# Altium schematic sheet VCXO_25M_DDMTD.SchDoc
size A4; SheetNumber: 7; SheetTotal: 18
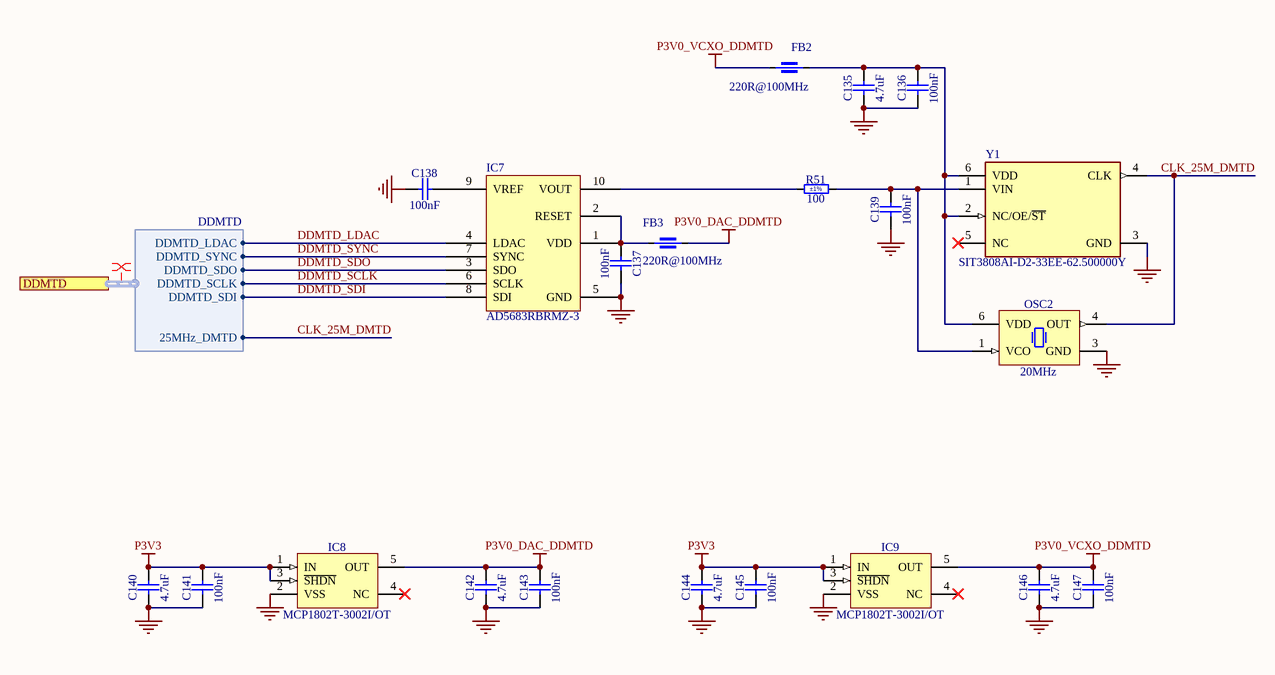
[diagram p0: VCXO_25M_DDMTD.SchDoc]

## Parts
C135  4.7uF  [CAPC1005X55N]
C136  100nF  [CAPC0603X33N]
C137  100nF  [CAPC0603X33N]
C138  100nF  [CAPC0603X33N]
C139  100nF  [CAPC2012X88N]
C140  4.7uF  [CAPC1005X55N]
C141  100nF  [CAPC0603X33N]
C142  4.7uF  [CAPC1005X55N]
C143  100nF  [CAPC0603X33N]
C144  4.7uF  [CAPC1005X55N]
C145  100nF  [CAPC0603X33N]
C146  4.7uF  [CAPC1005X55N]
C147  100nF  [CAPC0603X33N]
FB2  220R@100MHz  [INDC1608X95N]
FB3  220R@100MHz  [INDC1608X95N]
IC7  AD5683RBRMZ-3  [SOP50P490X109-10N]
IC8  MCP1802T-3002I/OT  [SOT95P270X145-5N]
IC9  MCP1802T-3002I/OT  [SOT95P270X145-5N]
OSC2  20MHz  [OSC_CONNOR-WINFIELD_DOT050V]
R51  100  Tolerance: ±1%  [RESC1005X40N]
Y1  SIT3808AI-D2-33EE-62.500000Y  [FP-SiT3808-D-MFG]

## Ports
DDMTD (harness DDMTD, see SPEC-A7-TOP[2B], FPGA_14_15[1D])

## Harnesses
DDMTD: DDMTD_LDAC, DDMTD_SYNC, DDMTD_SCLK, DDMTD_SDI, DDMTD_SDO, 25MHz_DMTD

## Nets
GND: C135.1 C136.1 C137.1 C138.1 C139.1 C140.1 C141.1 C142.1 C143.1 C144.1 C145.1 C146.1 C147.1 IC7.5(GND) IC8.2(VSS) IC9.2(VSS) OSC2.3(GND) Y1.3(GND)
P3V0_DAC_DDMTD: C142.2 C143.2 FB3.1 IC8.5(OUT)
P3V0_VCXO_DDMTD: C146.2 C147.2 FB2.1 IC9.5(OUT)
P3V3: C140.2 C141.2 C144.2 C145.2 IC8.1(IN) IC8.3(~{SHDN}) IC9.1(IN) IC9.3(~{SHDN})
CLK_25M_DMTD: OSC2.4(OUT) Y1.4(CLK) ; port DDMTD.25MHz_DMTD
DDMTD_LDAC: IC7.4(LDAC) ; port DDMTD.DDMTD_LDAC
DDMTD_SCLK: IC7.6(SCLK) ; port DDMTD.DDMTD_SCLK
DDMTD_SDI: IC7.8(SDI) ; port DDMTD.DDMTD_SDI
DDMTD_SDO: IC7.3(SDO) ; port DDMTD.DDMTD_SDO
DDMTD_SYNC: IC7.7(SYNC) ; port DDMTD.DDMTD_SYNC
NetC135_2: C135.2 C136.2 FB2.2 OSC2.6(VDD) Y1.2(NC/OE/~{ST}) Y1.6(VDD)
NetC137_2: C137.2 FB3.2 IC7.1(VDD) IC7.2(RESET)
NetC138_2: C138.2 IC7.9(VREF)
NetC139_2: C139.2 OSC2.1(VCO) R51.2 Y1.1(VIN)
NetIC7_10: IC7.10(VOUT) R51.1

Not connected (* = marked no-connect by the designer): IC8 4(NC)*; IC9 4(NC)*; Y1 5(NC)*

## Layout directives
net class DDMTD: (no net found under the mark)

## Library data of the parts
C135 C140 C142 C144 C146 = CC0402_4.7UF_6.3V_20%_X5R: Non-polarised capacitor; Part Description: SMD Multilayer Chip Ceramic Capacitor; Manufacturer: GENERIC; Manufacturer1 Part Number: C1005X5R0J475M050BC; Voltage: 6.3V; TC: X5R; Tolerance: ±20%; Part Number: CC0402_4.7UF_6.3V_20%_X5R; Component Kind: Standard; Component Type: Standard; Pin Count: 2; Value: 4.7uF; Status: Preferred; Manufacturer Part Number: CC0402_4.7UF_6.3V_20%_X5R; Case: 0402; Mounted: Yes; Socket: No; SMD: Yes; Sense: No; Manufacturer1 Example: TDK; Manufacturer1 ComponentHeight: 0.65mm; HelpURL: \\cern.ch\dfs\Applications\Altium\Datasheets\CC0402_X5R_TDK_C.pdf; Author: CERN DEM JLC; CreateDate: 03.03.2015; LatestRevisionDate: 03.03.2015
C136-C138 C141 C143 C145 C147 = CC0201_100NF_6.3V_10%_X5R: Non-polarised capacitor; Part Description: SMD Multilayer Chip Ceramic Capacitor; Manufacturer: GENERIC; Manufacturer1 Part Number: 02016D104KAT2A; Voltage: 6.3V; TC: X5R; Tolerance: ±10%; Part Number: CC0201_100NF_6.3V_10%_X5R; Component Kind: Standard; Component Type: Standard; Pin Count: 2; Value: 100nF; Status: Not Recommended; Manufacturer Part Number: CC0201_100NF_6.3V_10%_X5R; Case: 0201; Mounted: Yes; Socket: No; SMD: Yes; Sense: No; Manufacturer1 Example: AVX; Manufacturer1 ComponentHeight: 0.33mm; HelpURL: \\cern.ch\dfs\Applications\Altium\Datasheets\CC0201_X5R_AVX.pdf; Author: CERN DEM JLC; CreateDate: 03.12.2007; LatestRevisionDate: 03.12.2007
C139 = CC0805_100NF_50V_1%_NP0: Non-polarised capacitor; Part Description: SMD Multilayer Chip Ceramic Capacitor; Manufacturer: GENERIC; Manufacturer1 Part Number: 0805N103F500C; Voltage: 50V; TC: C0G/NP0; Tolerance: ±1%; Part Number: CC0805_100NF_50V_1%_NP0; Component Kind: Standard; Component Type: Standard; Footprint: CAPC2012X135N; Pin Count: 2; Value: 100nF; Status: Not Recommended; Manufacturer Part Number: CC0805_100NF_50V_1%_NP0; Case: 0805; Mounted: Yes; Socket: No; SMD: Yes; Sense: No; Manufacturer1 Example: WALSIN TECHNOLOGY CORPORATION; Manufacturer1 ComponentHeight: 1.35mm; HelpURL: \\cern.ch\dfs\Applications\Altium\Datasheets\CC0805_WALSIN_0805.pdf; Author: CERN DEM HF; CreateDate: 28.08.2023; LatestRevisionDate: 28.08.2023; ComponentHeight: 1.35mm
FB2 FB3 = IND0603_MURATA_BLM18SG221TN1: Part Description: SMD EMIFIL Suppression Chip Ferrite Bead; Manufacturer: MURATA; Tolerance: ±25%; Power: 2.5A; Resistance: 0.04R; Part Number: IND0603_MURATA_BLM18SG221TN1; Component Kind: Standard; Component Type: Standard; Pin Count: 2; Value: 220R@100MHz; Manufacturer Part Number: BLM18SG221TN1; Case: 0603; Mounted: Yes; Socket: No; SMD: Yes; Sense: No; ComponentHeight: 0.95mm; HelpURL: \\cern.ch\dfs\Applications\Altium\Datasheets\IND0603_MURATA_BLM18S.pdf; Author: CERN DEM MR; CreateDate: 08.01.2016; LatestRevisionDate: 25.10.2018
IC8 IC9 = MCP1802T-3002I/OT: 300mA, High PSRR, Low Quiescent Current LDO; Part Description: 3V, 300mA, High PSRR, Low Quiescent Current LDO; Manufacturer: MICROCHIP TECHNOLOGY; PressFit: No; Bonding: No; Part Number: MCP1802T-3002I/OT; Component Kind: Standard; Component Type: Standard; Device: MCP1802T-3002I/OT; PackageDescription: SOT, 0.95mm Pitch; 5 Pin,1.55mm W X 2.90mm L X 1.45mm H body, IPC Medium Density; Manufacturer Part Number: MCP1802T-3002I/OT; Pin Count: 3; Case: SOT23-5; Mounted: Yes; Socket: No; SMD: Yes; Sense: No; ComponentHeight: 1.45mm; HelpURL: \\cern.ch\dfs\Applications\Altium\Datasheets\MCP1802T-3002I-OT.pdf; Author: CERN DEM JLC; CreateDate: 03.05.2012; LatestRevisionDate: 17.09.2014
OSC2 = OSC_20MHZ_CONNOR-WINFIELD_DOT050V-020.0M: Oscillator 4 pins 1=VCO 3=GND 4=OUT 6=VCC; Part Description: 3.3V, ±0.05ppm, 15pF, 0 to 70°C, LVCMOS, Precision Surface Mount VCTCXO Temperature Compensated Crystal Oscillator, DOT050V Series; PressFit: No; Bonding: No; Part Number: OSC_20MHZ_CONNOR-WINFIELD_DOT050V-020.0M; Component Kind: Standard; Component Type: Standard; PackageDescription: SMD VCTCXO, Side Concave, 6 Pins, 9.00mm x 14.0mm, DOT050V Series; Value: 20MHz; Manufacturer: CONNOR-WINFIELD; Manufacturer Part Number: DOT050V-020.0M; Pin Count: 6; Mounted: Yes; Socket: No; SMD: Yes; Sense: No; ComponentHeight: 6.86mm; HelpURL: \\cern.ch\dfs\Applications\Altium\Datasheets\OSC_CONNOR-WINFIELD_DOT050V.pdf; Author: CERN DEM BC; CreateDate: 04.11.2016; LatestRevisionDate: 04.11.2016
R51 = R0402_100R_1%_0.0625W_100PPM: Resistor - 1%; Part Description: General Purpose Thick Film Chip Resistor; Manufacturer: GENERIC; Manufacturer1 Part Number: 232270671001L; TC: ±100ppm/°C; PressFit: No; Part Number: R0402_100R_1%_0.0625W_100PPM; Component Kind: Standard; Component Type: Standard; Pin Count: 2; Value: 100; Status: Not Recommended; Power: 0.0625W; Manufacturer Part Number: R0402_100R_1%_0.0625W_100PPM; Case: 0402; Mounted: Yes; Sense: No; Socket: No; SMD: Yes; Manufacturer1 Example: YAGEO PHYCOMP; Manufacturer1 ComponentHeight: 0.4mm; HelpURL: \\cern.ch\dfs\Applications\Altium\Datasheets\R0402_Phycomp_RC0402.pdf; Author: CERN DEM JLC; CreateDate: 03.12.2007; LatestRevisionDate: 17.10.2012
Y1 = CMP-25159-259533-1: MEMS OSC VCXO 62.500000MHZ LVCMOS